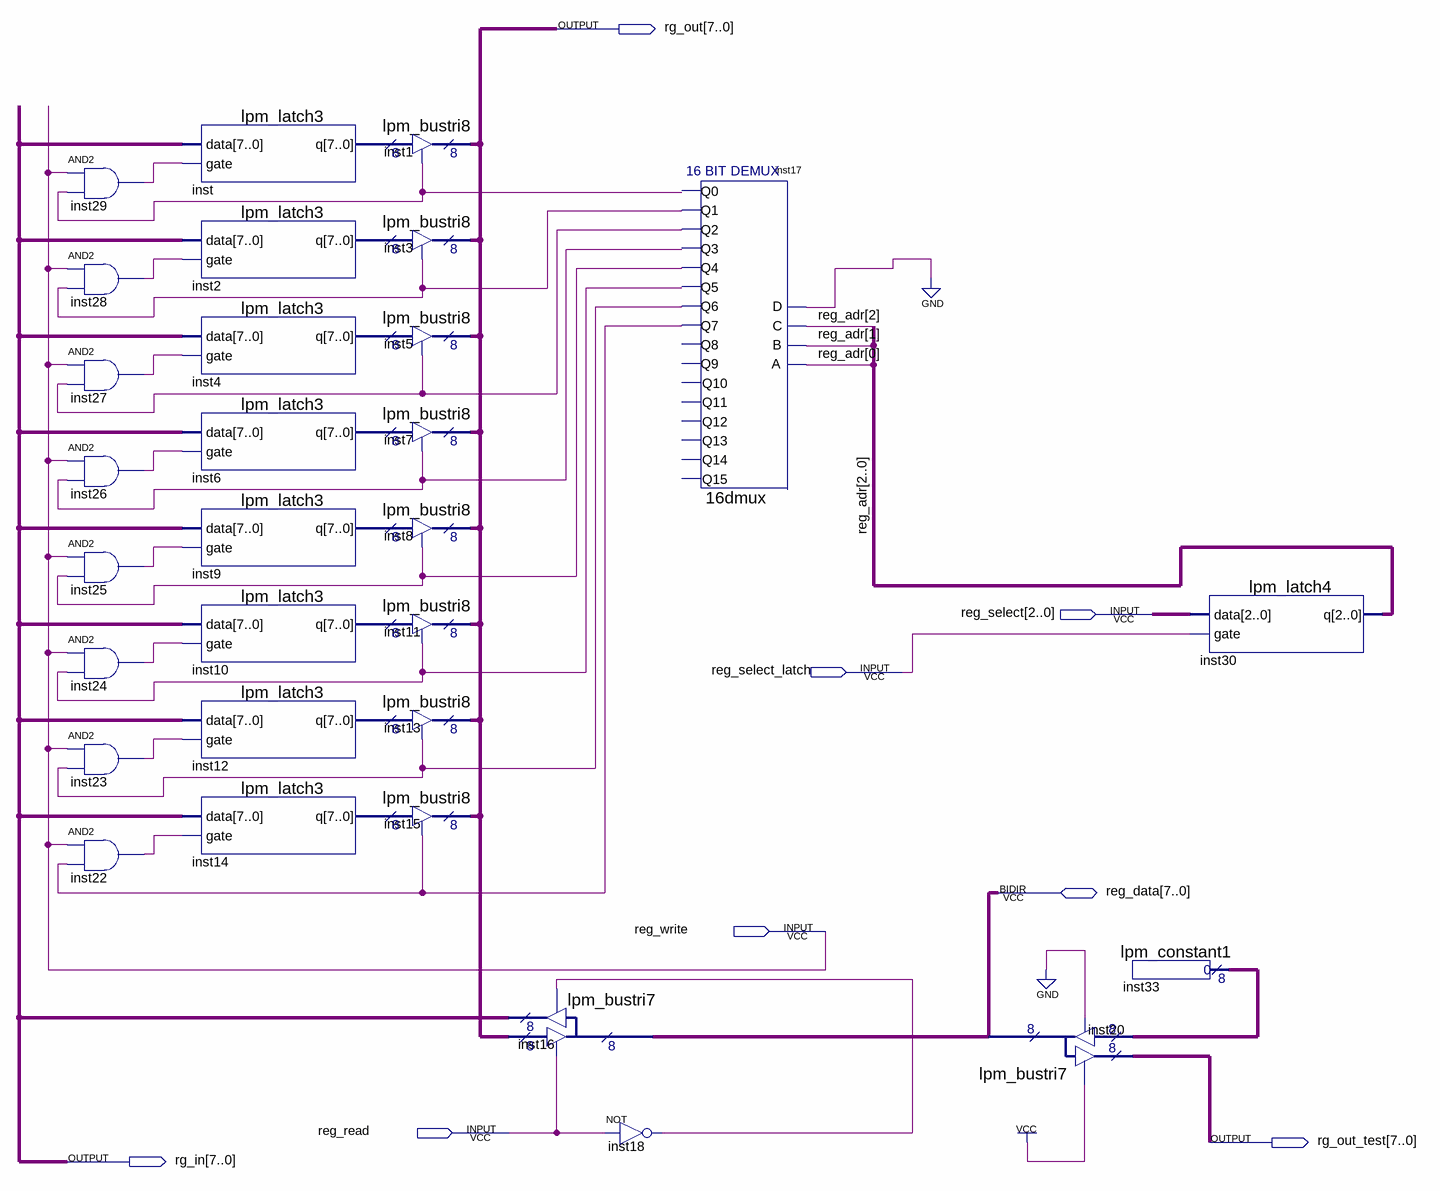
[diagram p0: schematic sheet]
// Quartus schematic reg_array.bdf as structural Verilog: 30 symbols, 8 pins
module reg_array (
  input  [2:0] reg_select,
  input  reg_select_latch,
  input  reg_write,
  input  reg_read,
  inout  [7:0] reg_data,
  output [7:0] rg_out,
  output [7:0] rg_out_test,
  output [7:0] rg_in
);

  wire inst17_q0, inst17_q1, inst17_q2, inst17_q3, inst17_q4, inst17_q5, inst17_q6, inst17_q7, inst18_out,
       inst22_out, inst23_out, inst24_out, inst25_out, inst26_out, inst27_out, inst28_out, inst29_out;
  wire [2:0] reg_adr;
  wire [7:0] inst2_q, inst4_q, inst6_q, inst9_q, inst10_q, inst12_q, inst14_q, inst33_result, inst_q;

  and inst29 (inst29_out, reg_write, inst17_q0);
  and inst28 (inst28_out, reg_write, inst17_q1);
  and inst27 (inst27_out, reg_write, inst17_q2);
  and inst26 (inst26_out, reg_write, inst17_q3);
  and inst25 (inst25_out, reg_write, inst17_q4);
  and inst24 (inst24_out, reg_write, inst17_q5);
  and inst23 (inst23_out, reg_write, inst17_q6);
  and inst22 (inst22_out, reg_write, inst17_q7);
  lpm_latch3 inst (.data(rg_in), .gate(inst29_out), .q(inst_q));
  lpm_latch3 inst2 (.data(rg_in), .gate(inst28_out), .q(inst2_q));
  lpm_latch3 inst4 (.data(rg_in), .gate(inst27_out), .q(inst4_q));
  lpm_latch3 inst6 (.data(rg_in), .gate(inst26_out), .q(inst6_q));
  lpm_latch3 inst9 (.data(rg_in), .gate(inst25_out), .q(inst9_q));
  lpm_latch3 inst10 (.data(rg_in), .gate(inst24_out), .q(inst10_q));
  lpm_latch3 inst12 (.data(rg_in), .gate(inst23_out), .q(inst12_q));
  lpm_latch3 inst14 (.data(rg_in), .gate(inst22_out), .q(inst14_q));
  lpm_bustri8 inst1 (.enabledt(inst17_q0), .data(inst_q), .tridata(rg_out));
  lpm_bustri8 inst3 (.enabledt(inst17_q1), .data(inst2_q), .tridata(rg_out));
  lpm_bustri8 inst5 (.enabledt(inst17_q2), .data(inst4_q), .tridata(rg_out));
  lpm_bustri8 inst7 (.enabledt(inst17_q3), .data(inst6_q), .tridata(rg_out));
  lpm_bustri8 inst8 (.enabledt(inst17_q4), .data(inst9_q), .tridata(rg_out));
  lpm_bustri8 inst11 (.enabledt(inst17_q5), .data(inst10_q), .tridata(rg_out));
  lpm_bustri8 inst13 (.enabledt(inst17_q6), .data(inst12_q), .tridata(rg_out));
  lpm_bustri8 inst15 (.enabledt(inst17_q7), .data(inst14_q), .tridata(rg_out));
  lpm_bustri7 inst16 (.enabledt(reg_read), .data(rg_out), .enabletr(inst18_out), .result(rg_in), .tridata(reg_data));
  not inst18 (inst18_out, reg_read);
  \16dmux  inst17 (
    .C(reg_adr[2]), .B(reg_adr[1]), .A(reg_adr[0]), .D(1'b0), .Q7(inst17_q7), .Q4(inst17_q4), .Q5(inst17_q5),
    .Q6(inst17_q6), .Q2(inst17_q2), .Q3(inst17_q3), .Q0(inst17_q0), .Q1(inst17_q1));  // open: Q12, Q13, Q11, Q9, Q10, Q8, Q14, Q15
  lpm_bustri7 inst20 (.enabledt(1'b0), .data(inst33_result), .enabletr(1'b1), .result(rg_out_test), .tridata(reg_data));
  lpm_constant1 inst33 (.result(inst33_result));
  lpm_latch4 inst30 (.data(reg_select), .gate(reg_select_latch), .q(reg_adr));

  // Other names for the same wires on the sheet: 8-800-555-35-35 = reg_write
endmodule
